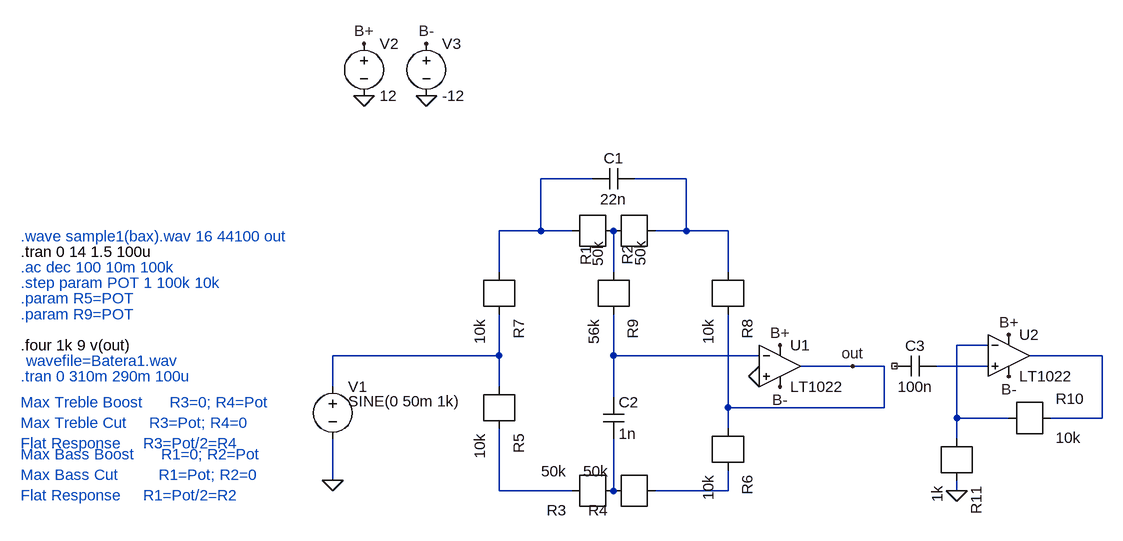
[diagram p0: schematic filtro ativo baxandall 5.asc]
filtro ativo baxandall 5.asc, the LTspice schematic file:
Version 4
SHEET 1 1376 708
WIRE 560 208 480 208
WIRE 704 208 624 208
WIRE 480 288 480 208
WIRE 480 288 416 288
WIRE 528 288 480 288
WIRE 704 288 704 208
WIRE 704 288 656 288
WIRE 768 288 704 288
WIRE 416 352 416 288
WIRE 592 352 592 288
WIRE 768 352 768 288
WIRE 1168 464 1120 464
WIRE 416 480 416 416
WIRE 416 480 160 480
WIRE 592 480 592 416
WIRE 816 480 592 480
WIRE 1344 480 1232 480
WIRE 960 496 880 496
WIRE 1008 496 960 496
WIRE 1168 496 1088 496
WIRE 160 528 160 480
WIRE 416 528 416 480
WIRE 592 544 592 480
WIRE 768 560 768 416
WIRE 1008 560 1008 496
WIRE 1008 560 768 560
WIRE 1120 576 1120 464
WIRE 1200 576 1120 576
WIRE 1344 576 1344 480
WIRE 1344 576 1264 576
WIRE 768 592 768 560
WIRE 1120 608 1120 576
WIRE 160 672 160 608
WIRE 416 688 416 592
WIRE 528 688 416 688
WIRE 592 688 592 608
WIRE 768 688 768 656
WIRE 768 688 656 688
WIRE 1120 688 1120 672
FLAG 816 512 0
FLAG 304 80 0
FLAG 208 80 0
FLAG 208 0 B+
FLAG 304 0 B-
FLAG 848 464 B+
FLAG 848 528 B-
FLAG 160 672 0
FLAG 1200 448 B+
FLAG 1200 512 B-
FLAG 1120 688 0
FLAG 960 496 out
SYMBOL r 592 288 R180
WINDOW 0 43 -54 VRight 2
WINDOW 3 24 -55 VRight 2
SYMATTR InstName R1
SYMATTR Value 50k
SYMBOL r 656 288 R180
WINDOW 0 43 -53 VRight 2
WINDOW 3 23 -54 VRight 2
SYMATTR InstName R2
SYMATTR Value 50k
SYMBOL r 592 688 R180
SYMATTR InstName R3
SYMATTR Value 50k
SYMBOL r 656 688 R180
SYMATTR InstName R4
SYMATTR Value 50k
SYMBOL r 416 528 R90
SYMATTR InstName R5
SYMATTR Value 10k
SYMBOL r 768 592 R90
SYMATTR InstName R6
SYMATTR Value 10k
SYMBOL r 416 352 R90
SYMATTR InstName R7
SYMATTR Value 10k
SYMBOL r 768 352 R90
SYMATTR InstName R8
SYMATTR Value 10k
SYMBOL r 592 352 R90
SYMATTR InstName R9
SYMATTR Value 56k
SYMBOL cap 624 192 R90
WINDOW 0 0 32 VBottom 2
WINDOW 3 32 32 VTop 2
SYMATTR InstName C1
SYMATTR Value 22n
SYMBOL cap 576 544 R0
SYMATTR InstName C2
SYMATTR Value 1n
SYMBOL voltage 160 512 R0
WINDOW 3 24 38 Left 2
SYMATTR Value SINE(0 50m 1k)
SYMATTR InstName V1
SYMATTR Value2 AC 1
SYMBOL voltage 208 -16 R0
SYMATTR InstName V2
SYMATTR Value 12
SYMBOL voltage 304 -16 R0
SYMATTR InstName V3
SYMATTR Value -12
SYMBOL opamps/LT1022 848 432 R0
SYMATTR InstName U1
SYMBOL cap 1088 480 R90
WINDOW 0 0 32 VBottom 2
WINDOW 3 32 32 VTop 2
SYMATTR InstName C3
SYMATTR Value 100n
SYMBOL opamps/LT1022 1200 416 R0
SYMATTR InstName U2
SYMBOL r 1200 576 R0
SYMATTR InstName R10
SYMATTR Value 10k
SYMBOL r 1120 608 R90
SYMATTR InstName R11
SYMATTR Value 1k
TEXT -320 344 Left 2 ;.ac dec 100 10m 100k
TEXT -320 464 Left 2 !.four 1k 9 v(out)
TEXT -320 320 Left 2 !.tran 0 14 1.5 100u
TEXT -320 368 Left 2 ;.step param POT 1 100k 10k
TEXT -320 392 Left 2 ;.param R5=POT
TEXT -320 416 Left 2 ;.param R9=POT
TEXT -312 488 Left 2 ;wavefile=Batera1.wav
TEXT -320 512 Left 2 ;.tran 0 310m 290m 100u
TEXT -320 632 Left 2 ;Max Bass Boost  	R1=0; R2=Pot\nMax Bass Cut 		R1=Pot; R2=0\nFlat Response 	R1=Pot/2=R2
TEXT -320 552 Left 2 ;Max Treble Boost  	R3=0; R4=Pot\nMax Treble Cut 	R3=Pot; R4=0\nFlat Response 	R3=Pot/2=R4
TEXT -320 296 Left 2 ;.wave sample1(bax).wav 16 44100 out

The netlist it stands for:
* filtro ativo baxandall 5.asc
R1 N001 N003 50k
R2 N003 N002 50k
R3 N009 N010 50k
R4 N010 N011 50k
R5 N009 N005 10k
R6 N011 out 10k
R7 N005 N001 10k
R8 out N002 10k
R9 N006 N003 56k
C1 N002 N001 22n
C2 N006 N010 1n
V1 N005 0 SINE(0 50m 1k) AC 1
V2 B+ 0 12
V3 B- 0 -12
XU1 0 N006 B+ B- out LT1022  ; pins In+ In- V+ V- OUT
C3 N008 NC_01 100n
XU2 N008 N004 B+ B- N007 LT1022  ; pins In+ In- V+ V- OUT
R10 N007 N004 10k
R11 0 N004 1k
* .ac dec 100 10m 100k
.four 1k 9 v(out)
.tran 0 14 1.5 100u
* .step param POT 1 100k 10k
* .param R5=POT
* .param R9=POT
* wavefile=Batera1.wav
* .tran 0 310m 290m 100u
* Max Bass Boost  	R1=0; R2=Pot
* Max Bass Cut 		R1=Pot; R2=0
* Flat Response 	R1=Pot/2=R2
* Max Treble Boost  	R3=0; R4=Pot
* Max Treble Cut 	R3=Pot; R4=0
* Flat Response 	R3=Pot/2=R4
* .wave sample1(bax).wav 16 44100 out
.backanno
.end